# EAGLE schematic SD81_WIFI (EAGLE 9.7.0)
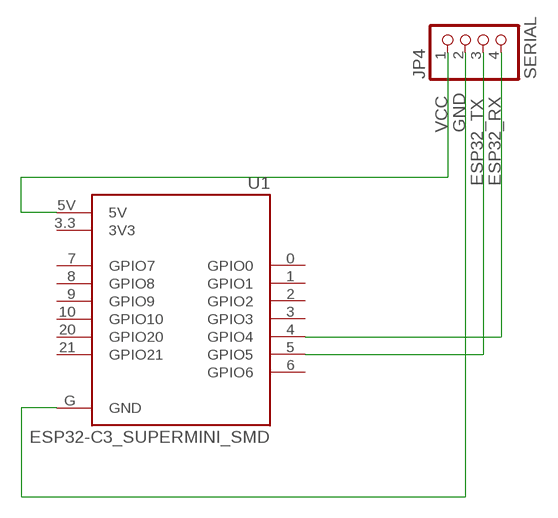
[diagram p0: schematic, sheet 1]

## Parts
JP4  SERIAL  PINHD-1X4  [1X04]
U1  ESP32-C3_SUPERMINI_SMD  [MODULE_ESP32-C3_SUPERMINI]

## Nets
ESP32_RX: JP4.4 U1.4(GPIO4)
ESP32_TX: JP4.3 U1.5(GPIO5)
GND [VCC]: JP4.2 U1.G(GND)
VCC [VCC]: JP4.1 U1.5V
Unconnected: U1.0(GPIO0) U1.1(GPIO1) U1.2(GPIO2) U1.3(GPIO3) U1.6(GPIO6) U1.7(GPIO7) U1.8(GPIO8) U1.9(GPIO9) U1.10(GPIO10) U1.20(GPIO20) U1.21(GPIO21)

## Power pins joined to a net without a drawn wire
3V3: U1.3.3(3V3)

## Library data of the parts
JP4 = pinhead:PINHD-1X4: PIN HEADER
U1 = ESP32-C3_SUPERMINI_SMD:ESP32-C3_SUPERMINI_SMD: Check availability <https://pricing.snapeda.com/parts/ESP32-C3%20SuperMini_SMD/Espressif%20Systems/view-part?ref=eda>

## Net classes
1 VCC: width 0.3 mm